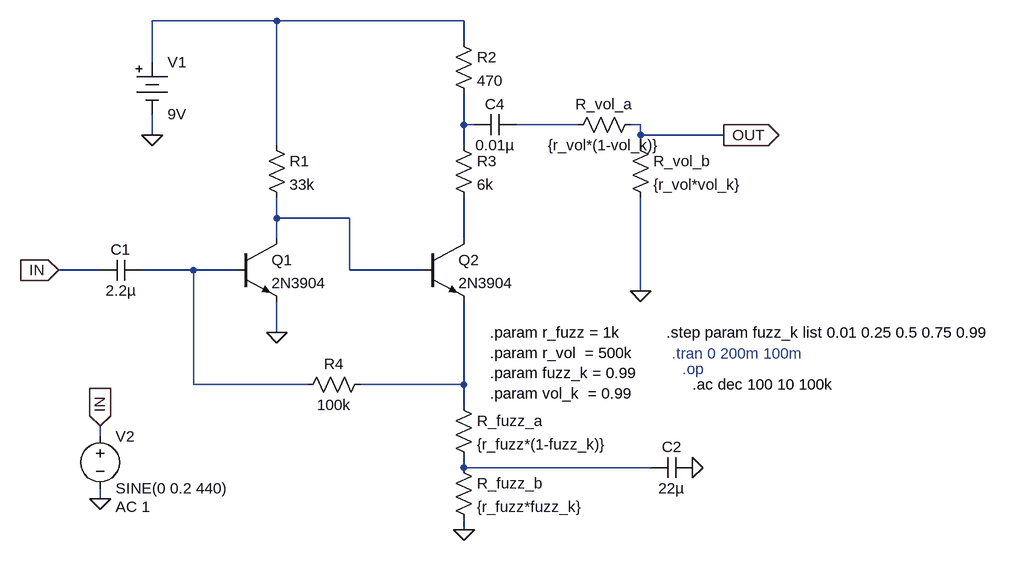
[diagram p0: schematic FuzzFace.asc]
FuzzFace.asc, the LTspice schematic file:
Version 4.1
SHEET 1 1240 772
WIRE 96 -32 -96 -32
WIRE 384 -32 96 -32
WIRE 384 0 384 -32
WIRE -96 32 -96 -32
WIRE 384 128 384 80
WIRE 400 128 384 128
WIRE 560 128 464 128
WIRE 656 128 640 128
WIRE -96 144 -96 112
WIRE 656 144 656 128
WIRE 784 144 656 144
WIRE 96 160 96 -32
WIRE 384 160 384 128
WIRE 656 160 656 144
WIRE 96 272 96 240
WIRE 208 272 96 272
WIRE 96 304 96 272
WIRE 384 304 384 240
WIRE -176 352 -240 352
WIRE -32 352 -112 352
WIRE 32 352 -32 352
WIRE 208 352 208 272
WIRE 320 352 208 352
WIRE 656 384 656 240
WIRE 96 448 96 400
WIRE -32 528 -32 352
WIRE 144 528 -32 528
WIRE 384 528 384 400
WIRE 384 528 224 528
WIRE 384 560 384 528
WIRE -176 608 -176 592
WIRE 384 656 384 640
WIRE 672 656 384 656
WIRE -176 704 -176 688
WIRE 384 752 384 736
FLAG -96 144 0
FLAG 96 448 0
FLAG 656 384 0
FLAG 784 144 OUT
IOPIN 784 144 Out
FLAG -240 352 IN
IOPIN -240 352 In
FLAG 384 752 0
FLAG 736 656 0
FLAG -176 704 0
FLAG -176 592 IN
IOPIN -176 592 In
SYMBOL res 80 144 R0
SYMATTR InstName R1
SYMATTR Value 33k
SYMBOL res 368 -16 R0
SYMATTR InstName R2
SYMATTR Value 470
SYMBOL res 368 144 R0
SYMATTR InstName R3
SYMATTR Value 6k
SYMBOL res 240 512 R90
WINDOW 0 0 56 VBottom 2
WINDOW 3 32 56 VTop 2
SYMATTR InstName R4
SYMATTR Value 100k
SYMBOL npn 32 304 R0
SYMATTR InstName Q1
SYMATTR Value 2N3904
SYMBOL npn 320 304 R0
SYMATTR InstName Q2
SYMATTR Value 2N3904
SYMBOL res 368 544 R0
SYMATTR InstName R_fuzz_a
SYMATTR Value {r_fuzz*(1-fuzz_k)}
SYMBOL res 368 640 R0
SYMATTR InstName R_fuzz_b
SYMATTR Value {r_fuzz*fuzz_k}
SYMBOL res 656 112 R90
WINDOW 0 0 56 VBottom 2
WINDOW 3 32 56 VTop 2
SYMATTR InstName R_vol_a
SYMATTR Value {r_vol*(1-vol_k)}
SYMBOL res 640 144 R0
SYMATTR InstName R_vol_b
SYMATTR Value {r_vol*vol_k}
SYMBOL cap -112 336 R90
WINDOW 0 0 32 VBottom 2
WINDOW 3 32 32 VTop 2
SYMATTR InstName C1
SYMATTR Value 2.2µ
SYMATTR Description Capacitor
SYMATTR Type cap
SYMATTR SpiceLine V=10 Irms=0 Rser=7 Lser=0 mfg="AVX" pn="TAJA225M010" type="Tantalum"
SYMBOL cap 672 672 R270
WINDOW 0 32 32 VTop 2
WINDOW 3 0 32 VBottom 2
SYMATTR InstName C2
SYMATTR Value 22µ
SYMATTR Description Capacitor
SYMATTR Type cap
SYMATTR SpiceLine V=16 Irms=0 Rser=1.6 Lser=0 mfg="AVX" pn="TAJC226K016" type="Tantalum"
SYMBOL cap 464 112 R90
WINDOW 0 0 32 VBottom 2
WINDOW 3 32 32 VTop 2
SYMATTR InstName C4
SYMATTR Value 0.01µ
SYMBOL Misc\\battery -96 16 R0
SYMATTR InstName V1
SYMATTR Value 9V
SYMBOL voltage -176 592 R0
WINDOW 123 24 124 Left 2
WINDOW 39 0 0 Left 0
SYMATTR InstName V2
SYMATTR Value SINE(0 0.2 440)
SYMATTR Value2 AC 1
TEXT 424 448 Left 2 !.param r_fuzz = 1k\n.param r_vol  = 500k\n.param fuzz_k = 0.99\n.param vol_k  = 0.99
TEXT 696 448 Left 2 !.step param fuzz_k list 0.01 0.25 0.5 0.75 0.99
TEXT 704 480 Left 2 ;.tran 0 200m 100m
TEXT 720 504 Left 2 ;.op
TEXT 736 528 Left 2 !.ac dec 100 10 100k

The netlist it stands for:
* FuzzFace.asc
R1 N001 N004 33k
R2 N001 N002 470
R3 N002 N005 6k
R4 N007 N006 100k
Q1 N004 N006 0 0 2N3904
Q2 N005 N004 N007 0 2N3904
R_fuzz_a N007 N008 {r_fuzz*(1-fuzz_k)}
R_fuzz_b N008 0 {r_fuzz*fuzz_k}
R_vol_a OUT N003 {r_vol*(1-vol_k)}
R_vol_b OUT 0 {r_vol*vol_k}
C1 N006 IN 2.2µ V=10 Irms=0 Rser=7 Lser=0 mfg="AVX" pn="TAJA225M010" type="Tantalum"
C2 N008 0 22µ V=16 Irms=0 Rser=1.6 Lser=0 mfg="AVX" pn="TAJC226K016" type="Tantalum"
C4 N003 N002 0.01µ
V1 N001 0 9V
V2 IN 0 SINE(0 0.2 440) AC 1
.model NPN NPN
.model PNP PNP
.lib standard.bjt
.param r_fuzz = 1k
.param r_vol  = 500k
.param fuzz_k = 0.99
.param vol_k  = 0.99
.step param fuzz_k list 0.01 0.25 0.5 0.75 0.99
* .tran 0 200m 100m
* .op
.ac dec 100 10 100k
.backanno
.end